# Altium schematic sheet BV100011_ControlAO.SchDoc
size A2
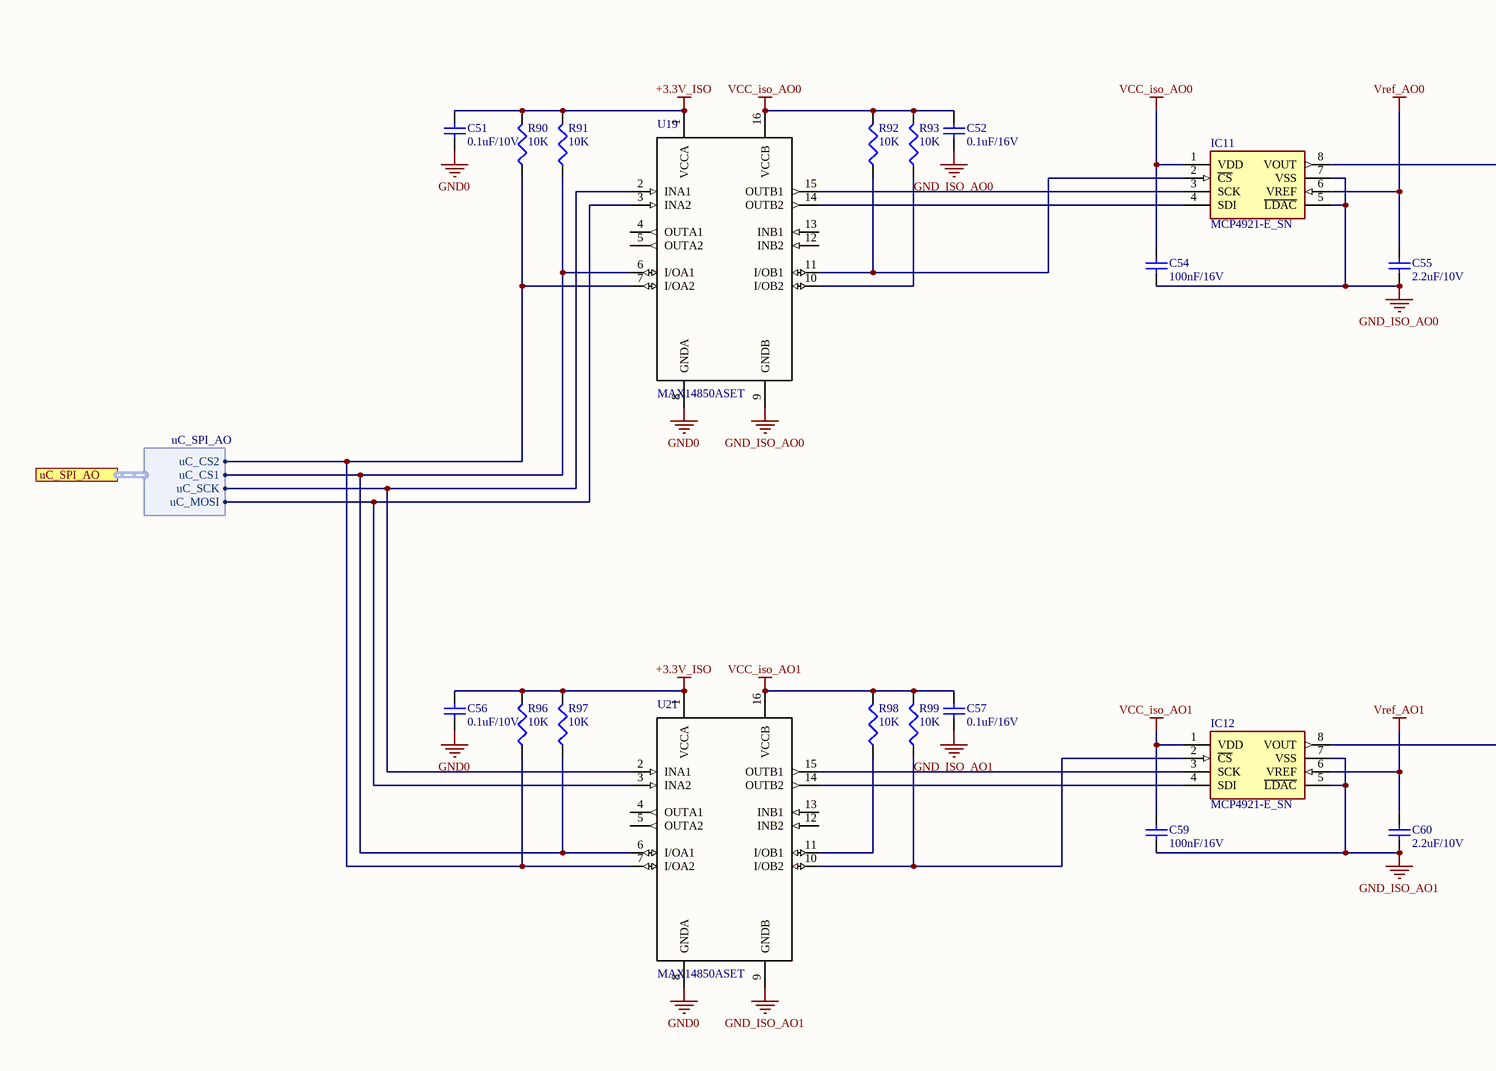
[diagram p0: BV100011_ControlAO.SchDoc, left]
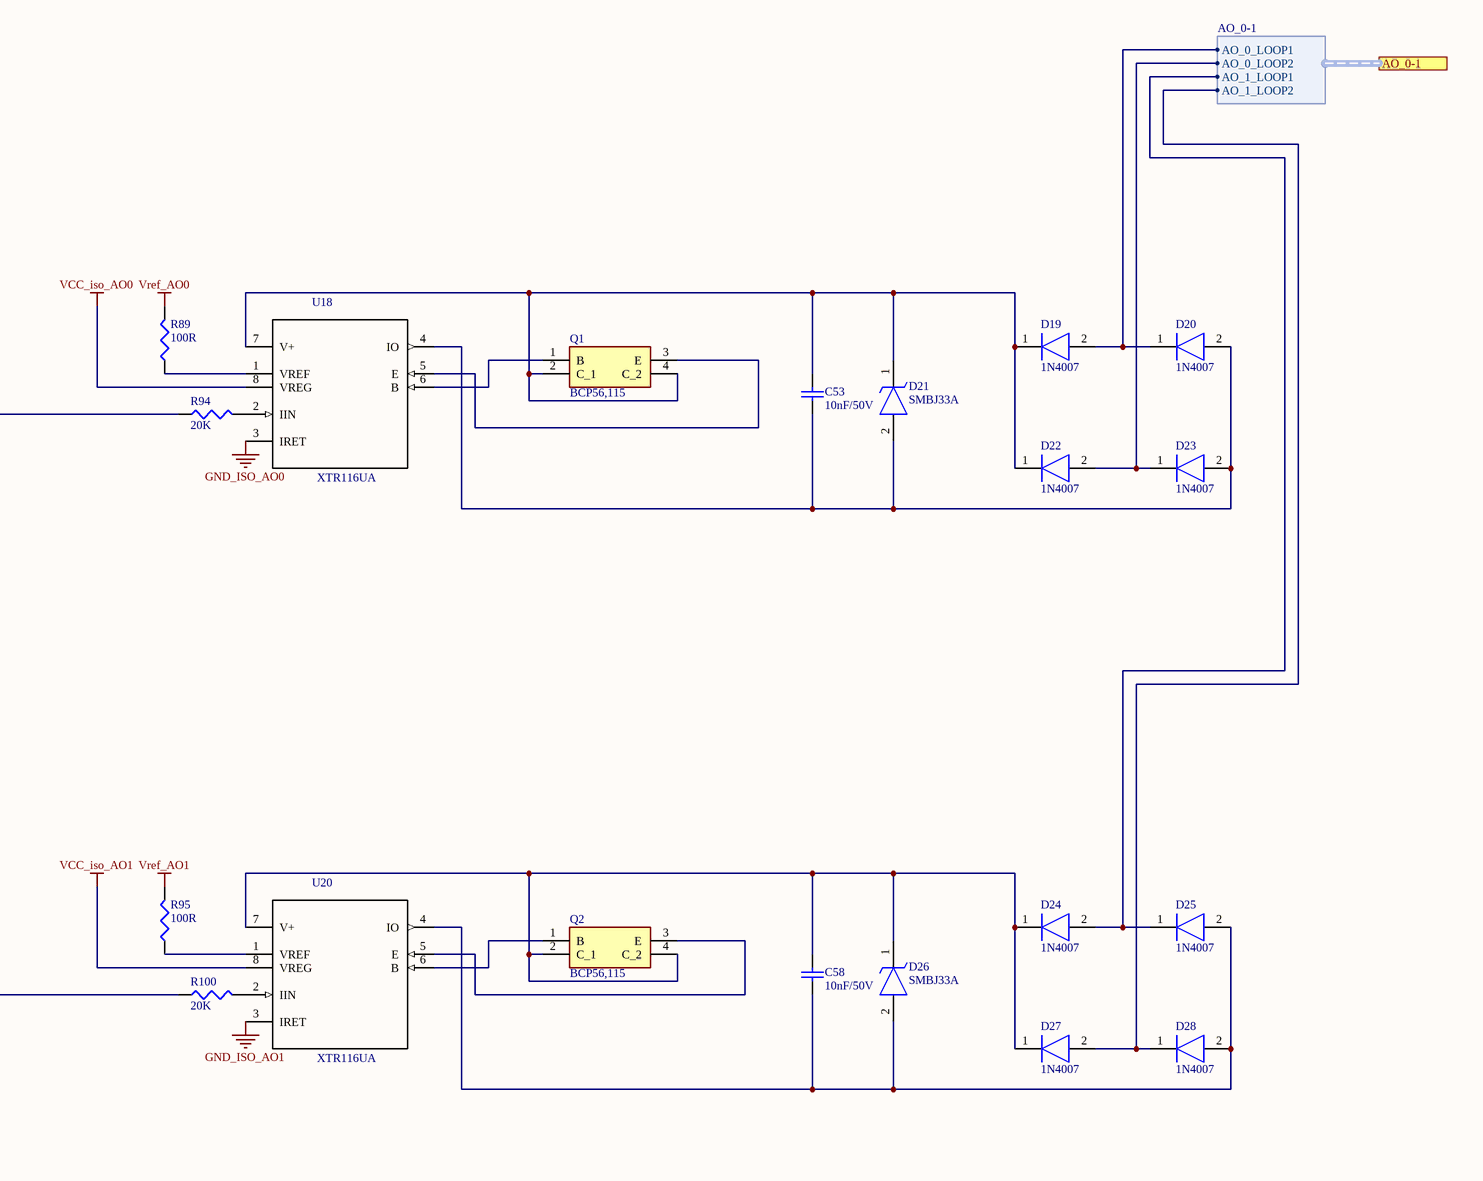
[diagram p1: BV100011_ControlAO.SchDoc, right]

## Parts
C51  0.1uF/10V  [C1206]
C52  0.1uF/16V  [C1206]
C53  10nF/50V  [C1210]
C54  100nF/16V  [C1206]
C55  2.2uF/10V  [C1206]
C56  0.1uF/10V  [C1206]
C57  0.1uF/16V  [C1206]
C58  10nF/50V  [C1210]
C59  100nF/16V  [C1206]
C60  2.2uF/10V  [C1206]
D19  1N4007  [DIOM5327X242N]
D20  1N4007  [DIOM5327X242N]
D21  SMBJ33A  [DIOM5336X265N]
D22  1N4007  [DIOM5327X242N]
D23  1N4007  [DIOM5327X242N]
D24  1N4007  [DIOM5327X242N]
D25  1N4007  [DIOM5327X242N]
D26  SMBJ33A  [DIOM5336X265N]
D27  1N4007  [DIOM5327X242N]
D28  1N4007  [DIOM5327X242N]
IC11  MCP4921-E_SN  [SOIC127P600X175-8N]
IC12  MCP4921-E_SN  [SOIC127P600X175-8N]
Q1  BCP56,115  [SOT230P700X180-4N]
Q2  BCP56,115  [SOT230P700X180-4N]
R89  100R  [J1-0603]
R90  10K  [J1-0603]
R91  10K  [J1-0603]
R92  10K  [J1-0603]
R93  10K  [J1-0603]
R94  20K  [J1-0603]
R95  100R  [J1-0603]
R96  10K  [J1-0603]
R97  10K  [J1-0603]
R98  10K  [J1-0603]
R99  10K  [J1-0603]
R100  20K  [J1-0603]
U18  XTR116UA  [*SOIC127P600X175-8N]
U19  MAX14850ASET  [*SOIC127P600X175-16N]
U20  XTR116UA  [*SOIC127P600X175-8N]
U21  MAX14850ASET  [*SOIC127P600X175-16N]

## Ports
AO_0-1 (harness AO_0-1), uC_SPI_AO (harness uC_SPI_AO)

## Harnesses
AO_0-1: AO_0_LOOP1, AO_0_LOOP2, AO_1_LOOP1, AO_1_LOOP2
uC_SPI_AO: uC_CS1, uC_CS2, uC_SCK, uC_MOSI

## Nets
+3.3V_ISO: C51.1 C56.1 R90.2 R91.2 R96.2 R97.2 U19.1(VCCA) U21.1(VCCA)
GND0: C51.2 C56.2 U19.8(GNDA) U21.8(GNDA)
GND_ISO_AO0: C52.2 C54.1 C55.1 IC11.5(~{LDAC}) IC11.7(VSS) U18.3(IRET) U19.9(GNDB)
GND_ISO_AO1: C57.2 C59.1 C60.1 IC12.5(~{LDAC}) IC12.7(VSS) U20.3(IRET) U21.9(GNDB)
VCC_iso_AO0: C52.1 C54.2 IC11.1(VDD) R92.2 R93.2 U18.8(VREG) U19.16(VCCB)
VCC_iso_AO1: C57.1 C59.2 IC12.1(VDD) R98.2 R99.2 U20.8(VREG) U21.16(VCCB)
Vref_AO0: C55.2 IC11.6(VREF) R89.2
Vref_AO1: C60.2 IC12.6(VREF) R95.2
NetC53_1: C53.1 D20.2(A) D21.2(A) D23.2(A) U18.4(IO)
NetC53_2: C53.2 D19.1(K) D21.1(K) D22.1(K) Q1.2(C_1) Q1.4(C_2) U18.7(V+)
NetC58_1: C58.1 D25.2(A) D26.2(A) D28.2(A) U20.4(IO)
NetC58_2: C58.2 D24.1(K) D26.1(K) D27.1(K) Q2.2(C_1) Q2.4(C_2) U20.7(V+)
NetD19_2: D19.2(A) D20.1(K) ; port AO_0-1.AO_0_LOOP1
NetD22_2: D22.2(A) D23.1(K) ; port AO_0-1.AO_0_LOOP2
NetD24_2: D24.2(A) D25.1(K) ; port AO_0-1.AO_1_LOOP1
NetD27_2: D27.2(A) D28.1(K) ; port AO_0-1.AO_1_LOOP2
NetIC11_2: IC11.2(~{CS}) R92.1 U19.11(I/OB1)
NetIC11_3: IC11.3(SCK) U19.15(OUTB1)
NetIC11_4: IC11.4(SDI) U19.14(OUTB2)
NetIC11_8: IC11.8(VOUT) R94.1
NetIC12_2: IC12.2(~{CS}) R99.1 U21.10(I/OB2)
NetIC12_3: IC12.3(SCK) U21.15(OUTB1)
NetIC12_4: IC12.4(SDI) U21.14(OUTB2)
NetIC12_8: IC12.8(VOUT) R100.1
NetQ1_1: Q1.1(B) U18.6(B)
NetQ1_3: Q1.3(E) U18.5(E)
NetQ2_1: Q2.1(B) U20.6(B)
NetQ2_3: Q2.3(E) U20.5(E)
NetR89_1: R89.1 U18.1(VREF)
NetR90_1: R90.1 R96.1 U19.7(I/OA2) U21.7(I/OA2) ; port uC_SPI_AO.uC_CS2
NetR91_1: R91.1 R97.1 U19.6(I/OA1) U21.6(I/OA1) ; port uC_SPI_AO.uC_CS1
NetR93_1: R93.1 U19.10(I/OB2)
NetR94_2: R94.2 U18.2(IIN)
NetR95_1: R95.1 U20.1(VREF)
NetR98_1: R98.1 U21.11(I/OB1)
NetR100_2: R100.2 U20.2(IIN)
NetU19_2: U19.2(INA1) U21.2(INA1) ; port uC_SPI_AO.uC_SCK
NetU19_3: U19.3(INA2) U21.3(INA2) ; port uC_SPI_AO.uC_MOSI

Not connected (* = marked no-connect by the designer): U19 4(OUTA1) 5(OUTA2) 12(INB2) 13(INB1); U21 4(OUTA1) 5(OUTA2) 12(INB2) 13(INB1)

## Library data of the parts
C51-C60 = Cap Semi: Capacitor (Semiconductor SIM Model); Published: 8-Jun-2000; LatestRevisionDate: 29-May-2009; LatestRevisionNote: IPC-7351 Footprint Added.; PackageReference: C1206; Publisher: Altium Limited; PackageDescription: Chip Capacitor
  C51 C56: Value: 0.1uF/10V
  C52 C57: Value: 0.1uF/16V
  C53 C58: Value: 10nF/50V
  C54 C59: Value: 100nF/16V
  C55 C60: Value: 2.2uF/10V
D19 D20 D22-D25 D27 D28 = 1N4007: Diode; Manufacturer_Name: Shikues; Datasheet Link: https://datasheet.lcsc.com/szlcsc/SK-1N4007_C126233.pdf; Height: 2.42mm; Manufacturer_Part_Number: 1N4007
D21 D26 = SMBJ33A: TVS Diode (Uni-directional); Manufacturer_Name: ON Semiconductor; Datasheet Link: http://www.onsemi.com/pub/Collateral/SMBJ9V0CA-D.pdf; Height: 2.65mm; Manufacturer_Part_Number: SMBJ33A; Mouser Part Number: 512-SMBJ33A; Mouser Price/Stock: https://www.mouser.com/Search/Refine.aspx?Keyword=512-SMBJ33A; RS Part Number: 8022320P; RS Price/Stock: http://uk.rs-online.com/web/p/products/8022320P
IC11 IC12 = MCP4921-E_SN: Integrated Circuit; Manufacturer_Name: Microchip; Manufacturer_Part_Number: MCP4921-E/SN; Allied_Number: 70046155; Datasheet Link: http://ww1.microchip.com/downloads/en/DeviceDoc/22248a.pdf; Height: 1.75mm; Mouser Part Number: 579-MCP4921-E/SN; Mouser Price/Stock: https://www.mouser.com/Search/Refine.aspx?Keyword=579-MCP4921-E%2FSN; RS Part Number: 0402803P; RS Price/Stock: http://uk.rs-online.com/web/p/products/0402803P; Allied Price/Stock: http://www.alliedelec.com/microchip-technology-inc-mcp4921-e-sn/70046155/
Q1 Q2 = BCP56,115: Transistor BJT NPN; Manufacturer_Name: Nexperia; Datasheet Link: https://assets.nexperia.com/documents/data-sheet/BCP56_BCX56_BC56PA.pdf; Height: 1.8mm; Manufacturer_Part_Number: BCP56,115; Mouser Part Number: 771-BCP56-T/R; Mouser Price/Stock: https://www.mouser.com/Search/Refine.aspx?Keyword=771-BCP56-T%2FR; RS Part Number: 1125453P; RS Price/Stock: http://uk.rs-online.com/web/p/products/1125453P
R89-R100 = Res3: Resistor; Published: 8-Jun-2000; LatestRevisionDate: 29-May-2009; LatestRevisionNote: IPC-7351 Footprint Added.; PackageReference: J1-0603; Publisher: Altium Limited; PackageDescription: Chip Resistor
  R89 R95: Value: 100R
  R90-R93 R96-R99: Value: 10K
  R94 R100: Value: 20K
U18 U20 = XTR116UA: Sensors, Sensor Conditioning, 4-20mA Transmitters 4-20mA Current Loop Transmitters; MF: Texas Instruments; SnapEDA_Link: https://www.snapeda.com/parts/XTR116UA/Texas%20Instruments/view-part/?ref=snap; MP: XTR116UA; Availability: Unavailable; Price: None; Package: SOIC-8 Texas Instruments; Value: *
U19 U21 = MAX14850ASET: Digital Isolator, 6-Ch, 30ns, Nsoic-16; MF: Maxim Integrated; MP: MAX14850ASE+; SnapEDA_Link: https://www.snapeda.com/parts/MAX14850ASE%2B/Maxim%20Integrated/view-part/?ref=snap; Availability: Unavailable; Price: None; Package: SOIC-16 Maxim; Value: *